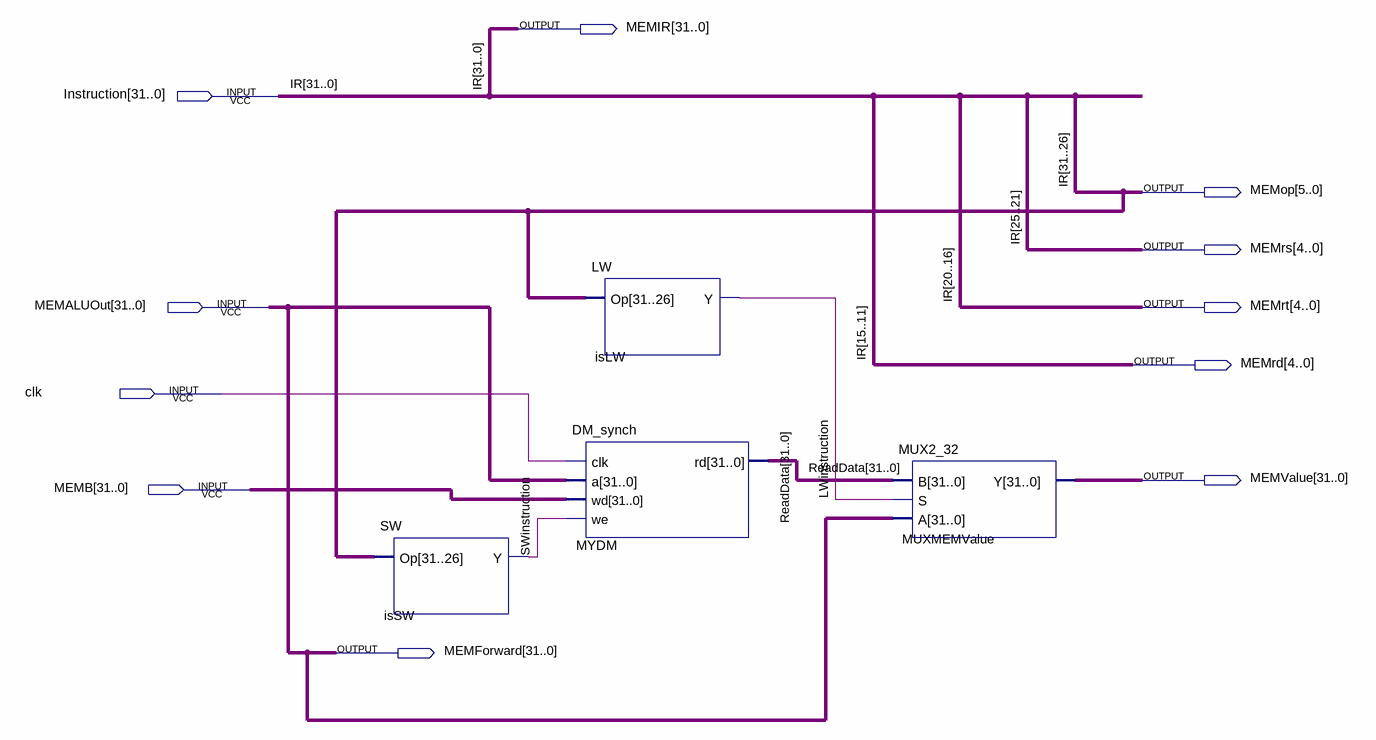
[diagram p0: schematic sheet]
// Quartus schematic MEMM.bdf as structural Verilog: 4 symbols, 11 pins
module MEMM (
  input  [31:0] Instruction,
  input  [31:0] MEMALUOut,
  input  clk,
  input  [31:0] MEMB,
  output [31:0] MEMIR,
  output [5:0] MEMop,
  output [4:0] MEMrs,
  output [4:0] MEMrt,
  output [4:0] MEMrd,
  output [31:0] MEMValue,
  output [31:0] MEMForward
);

  wire LWinstruction, SWinstruction;
  wire [31:0] ReadData;

  SW isSW (.Op(Instruction[31:26]), .Y(SWinstruction));
  LW isLW (.Op(Instruction[31:26]), .Y(LWinstruction));
  DM_synch MYDM (.clk(clk), .a(MEMALUOut), .wd(MEMB), .we(SWinstruction), .rd(ReadData));
  MUX2_32 MUXMEMValue (.B(ReadData), .S(LWinstruction), .A(MEMALUOut), .Y(MEMValue));

  assign MEMForward = MEMALUOut;
  assign MEMIR = Instruction;
  assign MEMop = Instruction[31:26];
  assign MEMrd = Instruction[15:11];
  assign MEMrs = Instruction[25:21];
  assign MEMrt = Instruction[20:16];

  // Other names for the same wires on the sheet: IR[31:0] = Instruction
endmodule
